# Altium project IRTxRx.PrjPCB
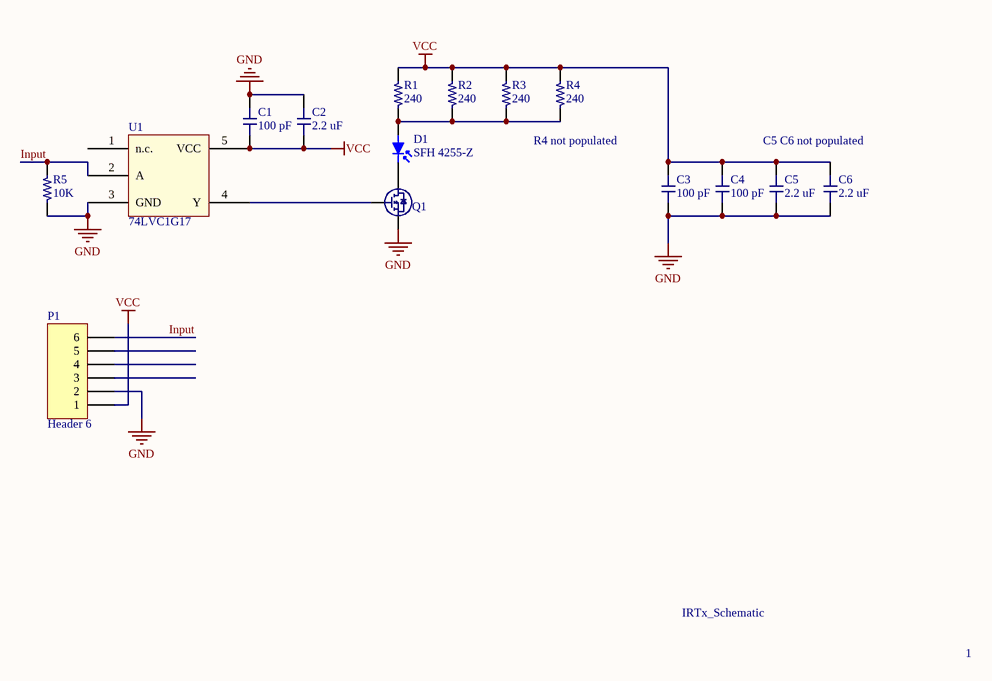
[diagram p0: IRTxRx.SchDoc]
1 sheet, 15 parts. Net scope: global (net labels, ports and power ports of the same name join across sheets).
Board files: IRTxRx.PcbDoc, IRTxRxPanel.PcbDoc

## Sheet IRTxRx.SchDoc
size A

### Parts
C1  value 100 pF  [C_0603]  (hidden comment: 06035A101JAT2A)
C2  value 2.2 uF  [C_0603]  (hidden comment: C1608X7R1A225K080AC)
C3  value 100 pF  [C_0603]  (hidden comment: 06035A101JAT2A)
C4  value 100 pF  [C_0603]  (hidden comment: 06035A101JAT2A)
C5  value 2.2 uF  [C_0603]  (hidden comment: C1608X7R1A225K080AC)
C6  value 2.2 uF  [C_0603]  (hidden comment: C1608X7R1A225K080AC)
D1  SFH 4255-Z  [SFH4255]
P1  Header 6  [HDR1X6]
Q1  ZXMN2A01FTA  [SOT23]  (value not drawn)
R1  value 240  [R_0603]  (hidden comment: RES 240 OHM 1/10W 1% 0603 SMD)
R2  value 240  [R_0603]  (hidden comment: RES 240 OHM 1/10W 1% 0603 SMD)
R3  value 240  [R_0603]  (hidden comment: RES 240 OHM 1/10W 1% 0603 SMD)
R4  value 240  [R_0603]  (hidden comment: RES 240 OHM 1/10W 1% 0603 SMD)
R5  value 10K  [R_0603]  (hidden comment: RES 10K OHM 1/10W 1% 0603 SMD)
U1  74LVC1G17  [SOT_353]

### Nets
GND: C1.2 C2.2 C3.2 C4.2 C5.2 C6.2 P1.2 Q1.2(S) R5.2 U1.3(GND)
VCC: C1.1 C2.1 C3.1 C4.1 C5.1 C6.1 P1.1 R1.1 R2.1 R3.1 R4.1 U1.5(VCC)
Input: P1.6 R5.1 U1.2(A)
NetD1_1: D1.1(anode) R1.2 R2.2 R3.2 R4.2
NetD1_2: D1.2(cathode) Q1.3(D)
NetQ1_1: Q1.1(G) U1.4(Y)

Not connected (* = marked no-connect by the designer): P1 3 4 5; U1 1(n.c.)

### Notes on the sheet
- R4 not populated
- C5 C6 not populated
- IRTx_Schematic
- 1

### Library data of the parts
C1 C3 C4 = 06035A101JAT2A: CAP CER 100PF 50V C0G/NP0 0603; Supplier 1: Digi-Key; Supplier Part Number 1: 478-1175-1-ND
C2 C5 C6 = CAP CER 2.2UF 10V 10% X7R 0603: Vishay VJ Series; Supplier 1: Digi-Key; Supplier Part Number 1: 445-5958-1-ND
D1 = SFH 4255-Z: EMITTER IR 860NM 100MA SMD; Supplier 1: Digi-Key; Supplier Part Number 1: 475-2568-1-ND
P1 = Header 6: Header, 6-Pin; LatestRevisionDate: 17-Jul-2002; LatestRevisionNote: Re-released for DXP Platform.; Publisher: Altium Limited
Q1 = ZXMN2A01FTA: MOSFET N-CH 20V 1.9A SOT23-3; Supplier 1: Digi-Key; Supplier Part Number 1: ZXMN2A01FCT-ND
R1-R4 = RES 240 OHM 1/10W 1% 0603 SMD: Panasonic ERJ-3EK; Supplier 1: Digi-Key; Supplier Part Number 1: P240HCT-ND
R5 = RES 10K OHM 1/10W 1% 0603 SMD: Panasonic ERJ-3EK; Supplier 1: Digi-Key; Supplier Part Number 1: P10.0KHCT-ND
U1 = 74LVC1G17: IC BUF NON-INVERT 5.5V 5TSSOP; Supplier 1: Digi-Key; Supplier Part Number 1: 1727-4117-1-ND